# EAGLE design connector_motor (EAGLE 7.2.0)
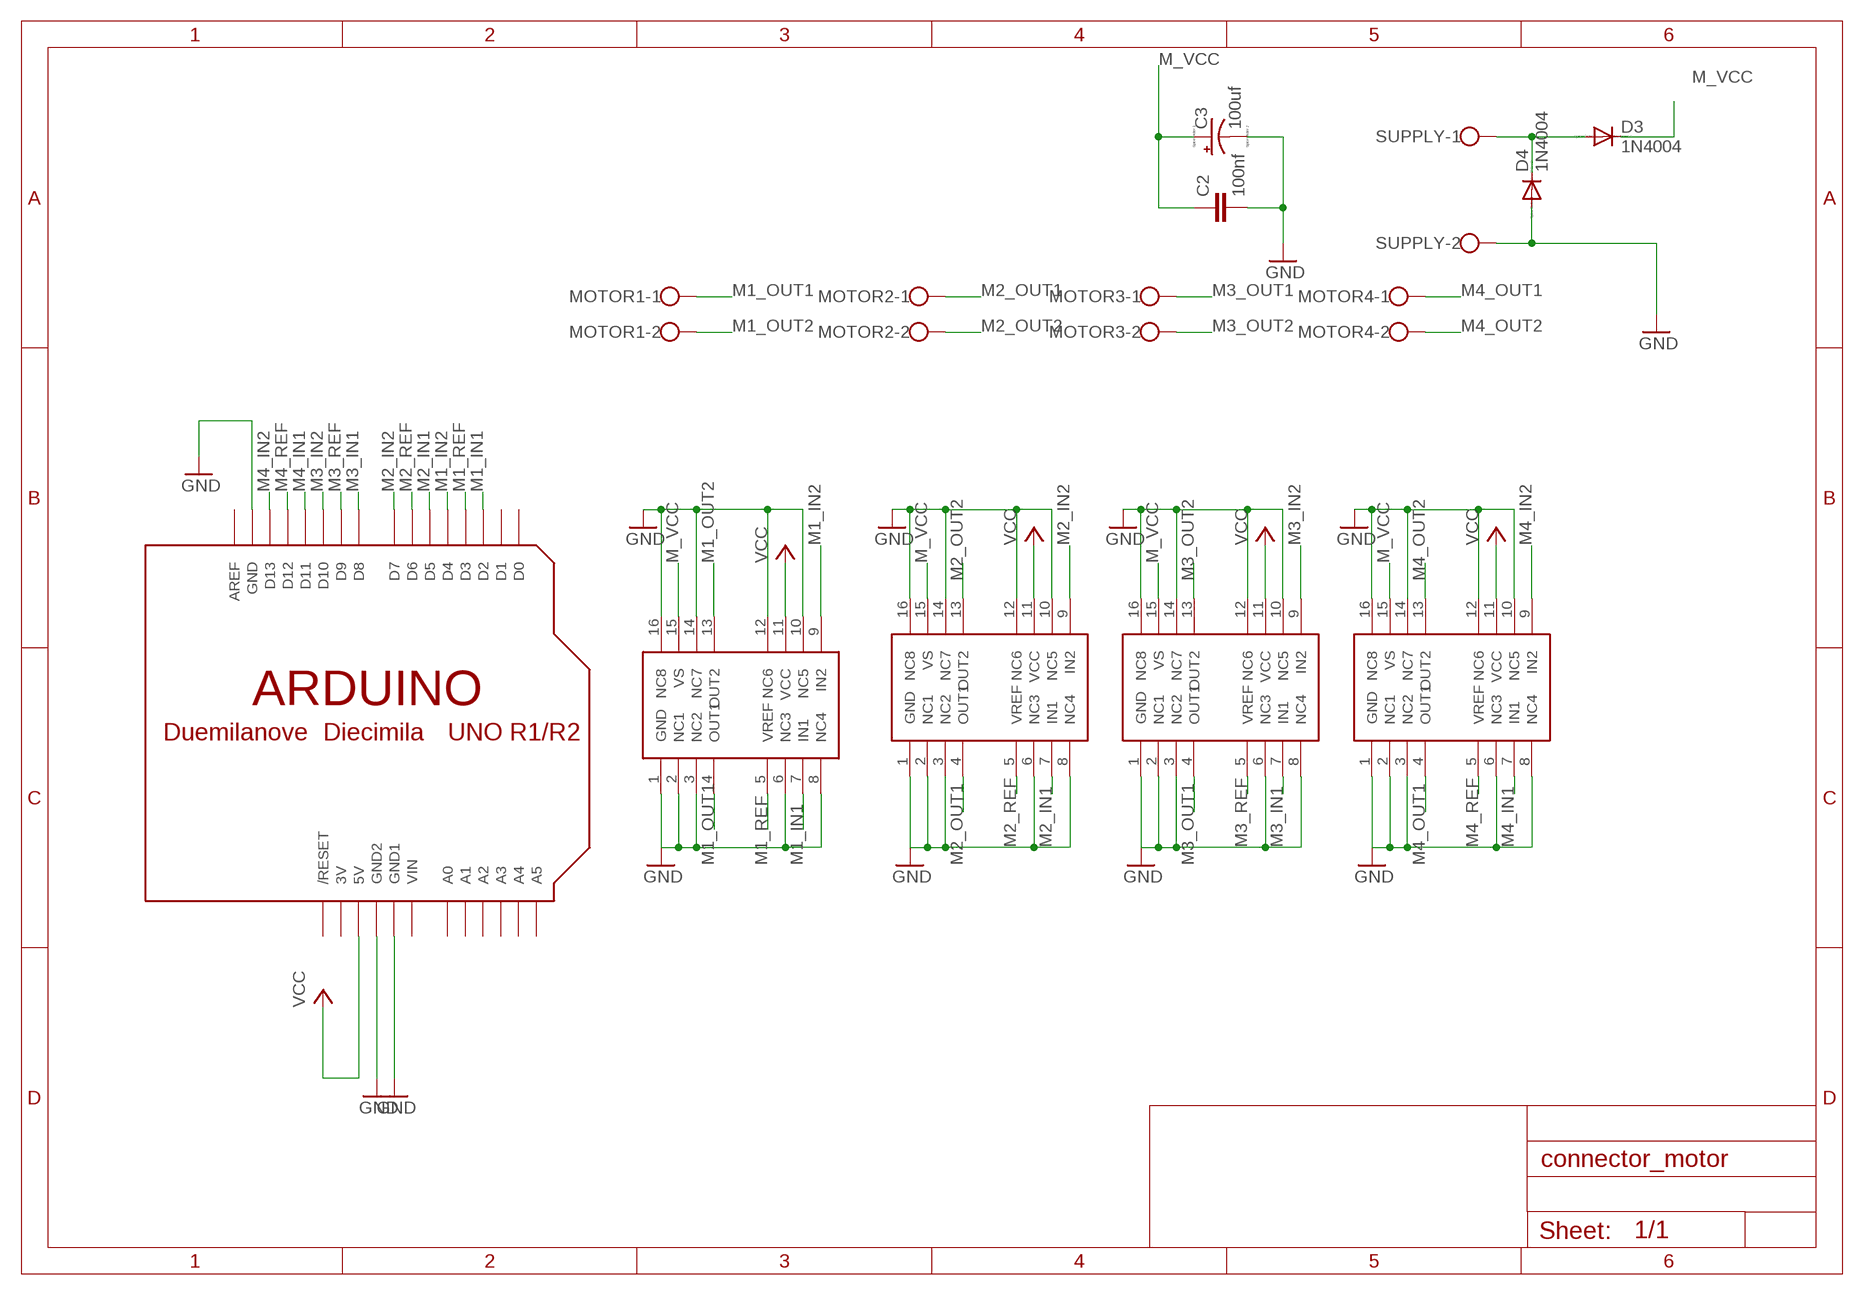
[diagram p0: schematic, sheet 1]

## Parts
C2  100nf  C-EUC0603  [C0603]
C3  100uf  CPOL-US153CLV-0405  [153CLV-0405]
D3  1N4004  [DO41-10]
D4  1N4004  [DO41-10]
MOTOR1  W237-102  [W237-102]
MOTOR2  W237-102  [W237-102]
MOTOR3  W237-102  [W237-102]
MOTOR4  W237-102  [W237-102]
SUPPLY  W237-102  [W237-102]
U$1  ARDUINO-NOHOLE  [ARDUINO-NOHOLE]
U$2  MOTOR-DRIVER-TA7281FG  [MOTOR-DRIVER-TA7291FG]
U$3  MOTOR-DRIVER-TA7281FG  [MOTOR-DRIVER-TA7291FG]
U$4  MOTOR-DRIVER-TA7281FG  [MOTOR-DRIVER-TA7291FG]
U$5  MOTOR-DRIVER-TA7281FG  [MOTOR-DRIVER-TA7291FG]

## Nets
GND: C2.2 C3.- D4.A SUPPLY.2 U$1.GND U$1.GND1 U$1.GND2 U$2.1(GND) U$2.2(NC1) U$2.3(NC2) U$2.6(NC3) U$2.8(NC4) U$2.10(NC5) U$2.12(NC6) U$2.14(NC7) U$2.16(NC8) U$3.1(GND) U$3.2(NC1) U$3.3(NC2) U$3.6(NC3) U$3.8(NC4) U$3.10(NC5) U$3.12(NC6) U$3.14(NC7) U$3.16(NC8) U$4.1(GND) U$4.2(NC1) U$4.3(NC2) U$4.6(NC3) U$4.8(NC4) U$4.10(NC5) U$4.12(NC6) U$4.14(NC7) U$4.16(NC8) U$5.1(GND) U$5.2(NC1) U$5.3(NC2) U$5.6(NC3) U$5.8(NC4) U$5.10(NC5) U$5.12(NC6) U$5.14(NC7) U$5.16(NC8)
M1_IN1: U$1.D2 U$3.7(IN1)
M1_IN2: U$1.D4 U$3.9(IN2)
M1_OUT1: MOTOR1.1 U$3.4(OUT1)
M1_OUT2: MOTOR1.2 U$3.13(OUT2)
M1_REF: U$1.D3 U$3.5(VREF)
M2_IN1: U$1.D5 U$4.7(IN1)
M2_IN2: U$1.D7 U$4.9(IN2)
M2_OUT1: MOTOR2.1 U$4.4(OUT1)
M2_OUT2: MOTOR2.2 U$4.13(OUT2)
M2_REF: U$1.D6 U$4.5(VREF)
M3_IN1: U$1.D8 U$2.7(IN1)
M3_IN2: U$1.D10 U$2.9(IN2)
M3_OUT1: MOTOR3.1 U$2.4(OUT1)
M3_OUT2: MOTOR3.2 U$2.13(OUT2)
M3_REF: U$1.D9 U$2.5(VREF)
M4_IN1: U$1.D11 U$5.7(IN1)
M4_IN2: U$1.D13 U$5.9(IN2)
M4_OUT1: MOTOR4.1 U$5.4(OUT1)
M4_OUT2: MOTOR4.2 U$5.13(OUT2)
M4_REF: U$1.D12 U$5.5(VREF)
M_VCC: C2.1 C3.+ D3.C U$2.15(VS) U$3.15(VS) U$4.15(VS) U$5.15(VS)
N$1: D3.A D4.C SUPPLY.1
VCC: U$1.5V U$2.11(VCC) U$3.11(VCC) U$4.11(VCC) U$5.11(VCC)
Unconnected: U$1.A0 U$1.A1 U$1.A2 U$1.A3 U$1.A4 U$1.A5 U$1.AREF U$1.D0 U$1.D1 U$1.RESET(/RESET)

## Power pins joined to a net without a drawn wire
3V: U$1.3V
VIN: U$1.VIN

## Library data of the parts
C2 = rcl:C-EU: CAPACITOR, European symbol
C3 = resistor:CPOL-US: POLARIZED CAPACITOR, American symbol
D3 D4 = diode:1N4004: DIODE general purpose rectifier, 1 A
MOTOR1-MOTOR4 SUPPLY = con-wago-500:W237-102: WAGO SCREW CLAMP; MPN: 237-102; OC_FARNELL: unknown; OC_NEWARK: 70K9898
U$1 = adafruit:ARDUINO: Arduino Diecimila/Duemilanove Make a shield with ease, this package has all the named pins as well as the two mounting drill holes and an outline of the USB and DC power connector. The outline is on the DIMENSION layer, so if your board house uses it they will cut the outline to match. http://www.ladyada.net/library/pcb/eaglelibrary.html
U$2-U$5 = gclue:MOTOR-DRIVER-TA7281FG

## Board
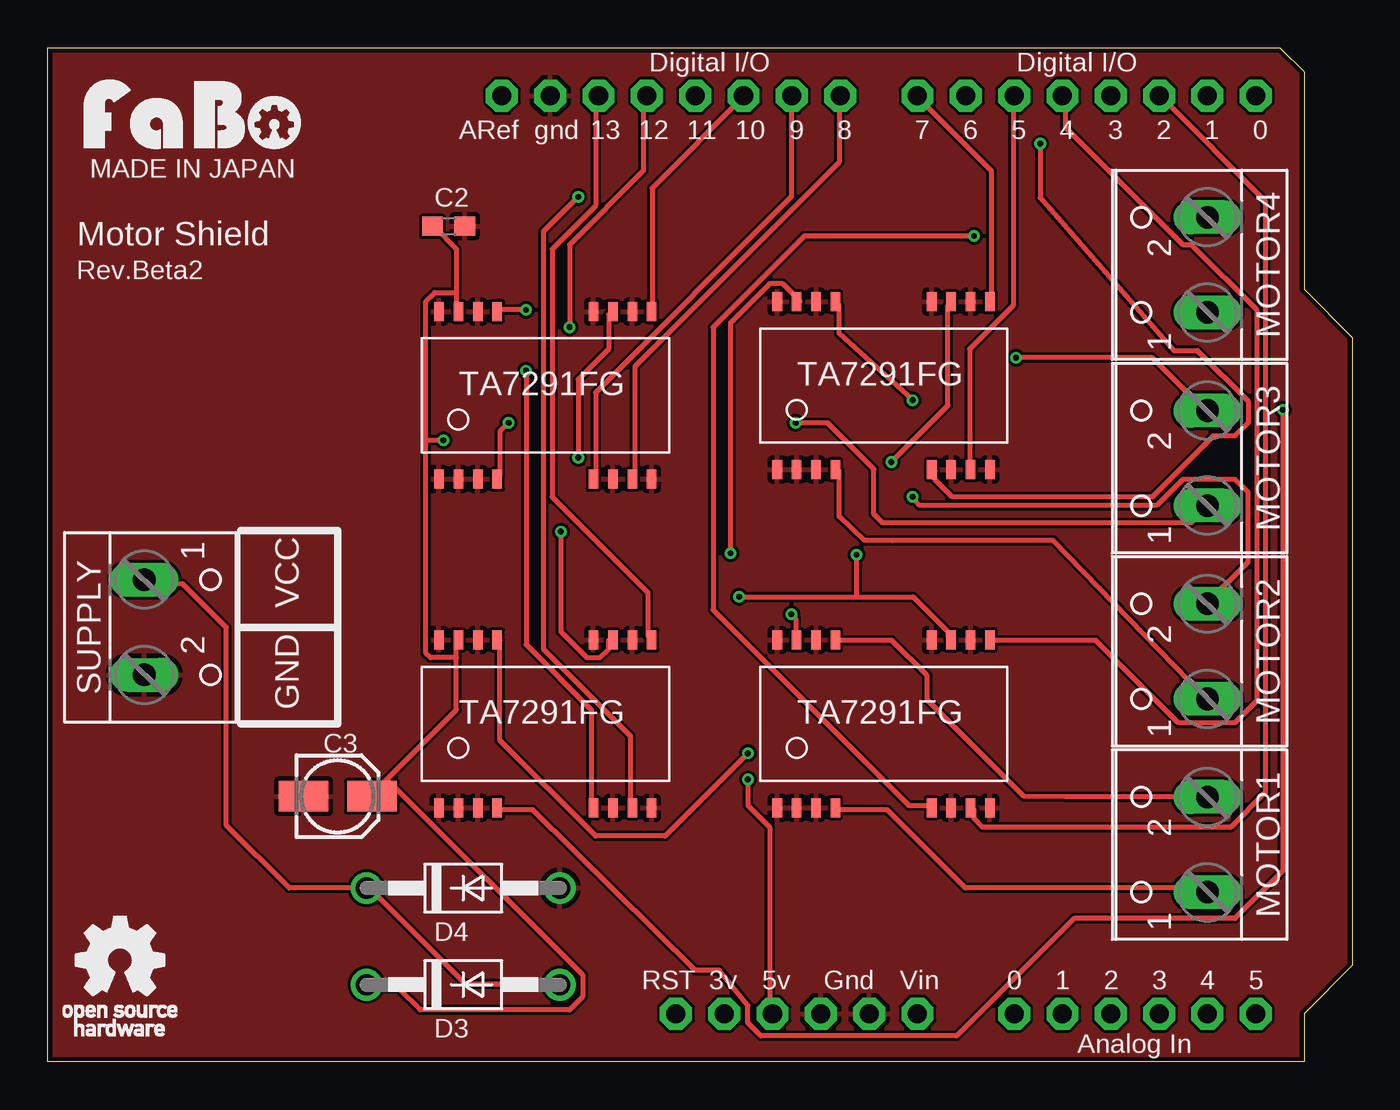
[diagram p1: board, top side]
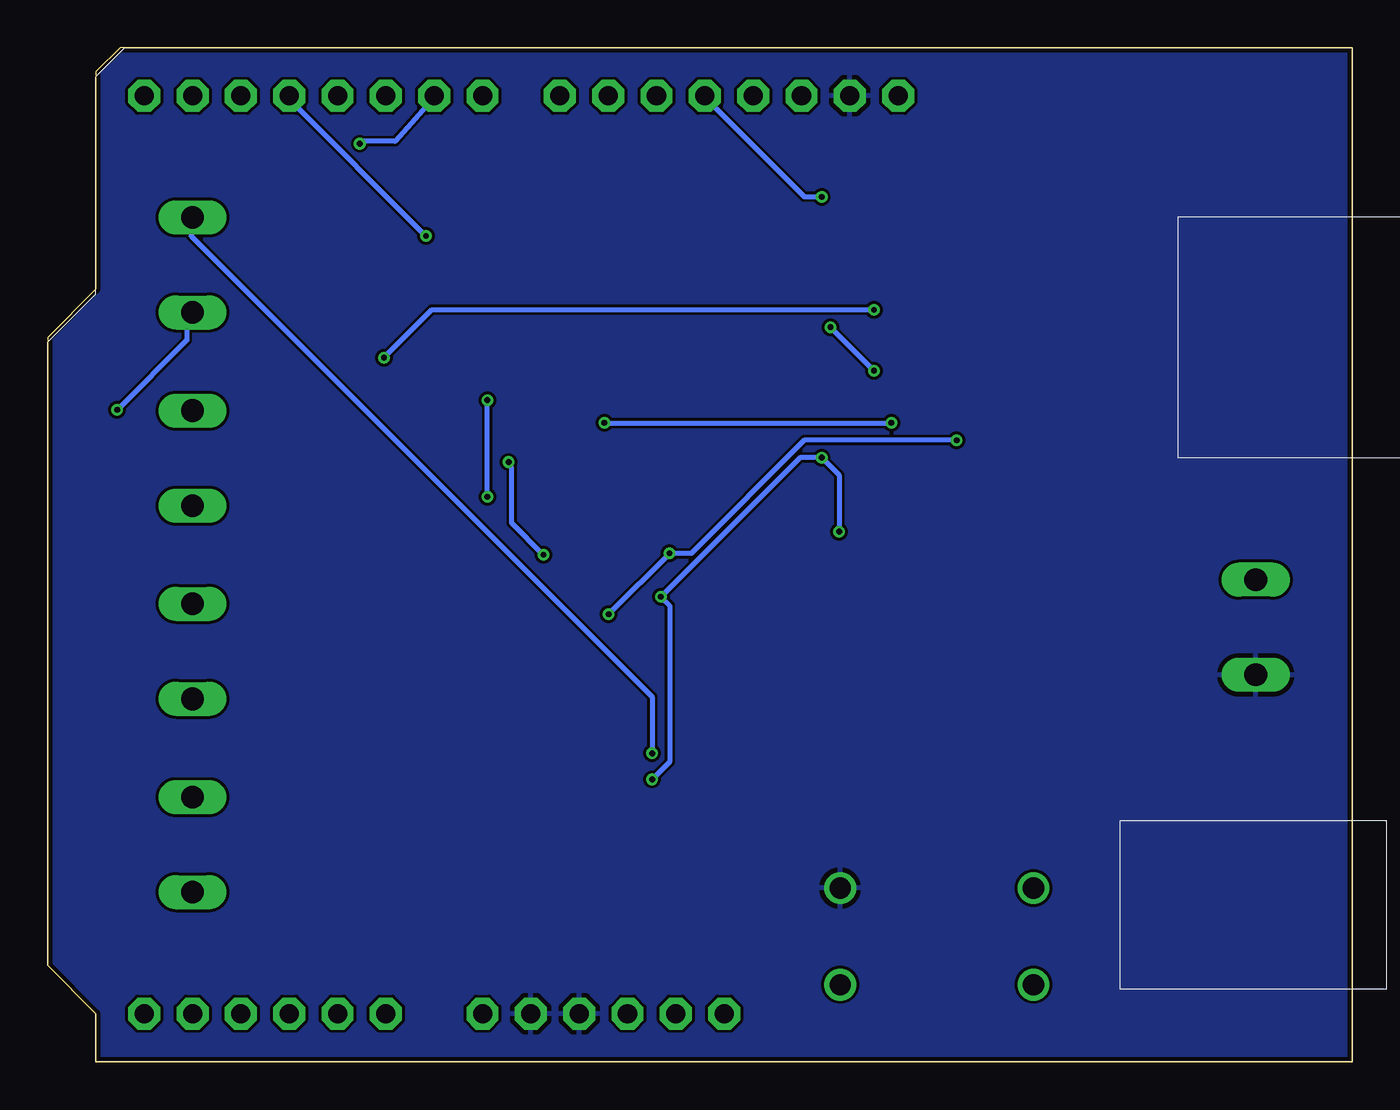
[diagram p2: board, bottom side, seen from below]

Size 68.58 x 53.34 mm. Coordinates in mm from the lower left corner, seen from the top.
Outline: 0,0 0,53.34 64.77,53.34 66.04,52.07 66.04,40.64 68.58,38.1 68.58,5.08 66.04,2.54 66.04,0 0,0
Copper layers (1*16): Top 0.035mm / dielectric 1.5mm / Bottom 0.035mm
Design rules "Elecrow_2-layer_eagle_rule": minimum track width 6mil, minimum drill 12mil, track to track 6mil, track to pad 6mil, pad to pad 6mil, via to via 6mil, smd to smd 0mil, copper to edge 10mil, drill to drill 10mil, minimum pad ring 10mil, minimum via ring 6mil, stop-mask expansion 2mil, vias tented up to drill 100mil, thermal gap 10mil

### Footprints (pad centres in the part's own frame; a part is rotated, then mirrored left to right if it is on the bottom)
C0603 = smd 1.1 x 1: 1 -0.85,0; 2 0.85,0
153CLV-0405 = smd 2.6 x 1.6: + 1.8,0; - -1.8,0
DO41-10 = drill 1.118: A 5.08,0; C -5.08,0
W237-102 = drill 1.194 long: 1 -2.5,-1.27; 2 2.5,-1.27
ARDUINO-NOHOLE = drill 1 pad 1.676 octagon: 3V 35.56,2.54; 5V 38.1,2.54; A0 50.8,2.54; A1 53.34,2.54; A2 55.88,2.54; A3 58.42,2.54; A4 60.96,2.54; A5 63.5,2.54; AREF 23.876,50.8; D0 63.5,50.8; D1 60.96,50.8; D2 58.42,50.8; D3 55.88,50.8; D4 53.34,50.8; D5 50.8,50.8; D6 48.26,50.8; D7 45.72,50.8; D8 41.656,50.8; D9 39.116,50.8; D10 36.576,50.8; D11 34.036,50.8; D12 31.496,50.8; D13 28.956,50.8; GND 26.416,50.8; GND1 43.18,2.54; GND2 40.64,2.54; RESET 33.02,2.54; VIN 45.72,2.54
MOTOR-DRIVER-TA7291FG = smd 0.5 x 1: 1 -6.1,-4.41; 2 -5.08,-4.41; 3 -4.06,-4.41; 4 -3.04,-4.41; 5 2.02,-4.41; 6 3.04,-4.41; 7 4.06,-4.41; 8 5.08,-4.41; 9 5.08,4.41; 10 4.06,4.41; 11 3.04,4.41; 12 2.02,4.41; 13 -3.04,4.41; 14 -4.06,4.41; 15 -5.08,4.41; 16 -6.1,4.41

### Placement (x,y rotation side)
C2  21.08,43.94 0 top
C3  15.24,13.97 0 top
D3  21.84,4.06 0 top
D4  21.84,9.14 0 top
MOTOR1  59.69,11.43 90 top
MOTOR2  59.69,21.59 90 top
MOTOR3  59.69,31.75 90 top
MOTOR4  59.69,41.91 90 top
SUPPLY  6.35,22.86 270 top
U$1  0,0 0 top
U$2  26.67,35.05 0 top
U$3  44.45,17.78 0 top
U$4  44.45,35.56 0 top
U$5  26.67,17.78 0 top
U$7  [LOGO_FABO_M]  7.62,48.01 0 top
U$8  [LOGO_OSHW_T_M]  3.81,5.33 0 top

### Tracks (layer width: path | path; a pad name or v marks a point on that pad's centre or on a via)
GND
  pour Bottom: -1.27,54.61 69.85,54.61 69.85,-1.27 -1.27,-1.27
  pour Top: -1.27,54.61 69.85,54.61 69.85,-1.27 -1.27,-1.27
M1_IN1
  Top 0.254: U$3.7 48.69,13.26 48.69,12.8 49.15,12.34 62.18,12.34 64.01,14.17 64.01,45.26 58.52,50.75 U$1.D2
M1_IN2
  Top 0.254: U$3.9 49.61,22.17 55.09,22.17 59.44,17.83 62.41,17.83 63.55,18.97 63.55,39.55 60.12,42.98 59.66,42.98 53.49,49.15 53.49,50.75 U$1.D4
M1_OUT1
  Top 0.254: U$3.4 41.6,13.26 44.12,13.26 48.23,9.14 60.81,9.14 MOTOR1.1
M1_OUT2
  Top 0.254: U$3.13 41.6,22.17 44.37,22.17 46.23,20.32 46.23,19.05 51.31,13.97 53.49,13.95 60.81,13.95 MOTOR1.2
M1_REF  (via drill 0.3)
  Top 0.254: v48.69,43.43 39.78,43.43 34.98,38.63 34.98,23.77 45.26,13.49 46.41,13.49 U$3.5
  Bottom 0.254: v48.69,43.43 56.01,50.75 U$1.D3
M2_IN1
  Top 0.254: U$4.7 48.46,31.32 48.46,37.49 50.75,39.78 50.75,50.75 U$1.D5
M2_IN2
  Top 0.254: U$4.9 49.61,40.01 49.61,46.86 45.72,50.75 U$1.D7
M2_OUT1
  Top 0.254: U$4.4 41.6,31.09 41.6,28.68 42.93,27.43 44.12,27.43 44.4,27.41 52.86,27.41 60.81,19.2 MOTOR2.1
M2_OUT2  (via drill 0.3)
  Top 0.254: v45.47,34.8 41.6,38.3 41.6,39.78 U$4.13 | v45.47,29.72 45.82,29.26 58.29,29.26 59.66,30.63 62.41,30.63 63.09,29.95 63.09,26.29 61.04,24.23 MOTOR2.2
  Bottom 0.254: v45.47,29.72 v45.47,34.8
M2_REF  (via drill 0.3)
  Top 0.254: v52.17,48.28 52.17,45.44 59.18,37.41 60.43,37.41 63.09,34.75 63.09,33.6 62.41,32.92 61.27,32.92 58.06,29.72 47.55,29.72 46.63,30.63 46.63,31.09 U$4.5
  Bottom 0.254: v52.17,48.28 52.05,48.41 50.32,48.41 48.23,50.75 U$1.D6
M3_IN1
  Top 0.254: U$2.7 30.86,30.86 30.86,36.58 41.6,47.32 41.6,50.75 U$1.D8
M3_IN2
  Top 0.254: U$2.9 31.77,39.55 31.77,45.95 36.58,50.75 U$1.D10
M3_OUT1  (via drill 0.3)
  Top 0.254: v24.23,33.6 23.77,33.15 23.77,30.86 U$2.4 | v39.32,33.6 41,33.6 43.43,31.17 43.43,28.8 43.89,28.35 60.12,28.35 60.81,29.03 MOTOR3.1
  Bottom 0.254: v39.32,33.6 v24.23,33.6
M3_OUT2  (via drill 0.3)
  Top 0.254: v25.15,39.55 23.77,39.55 U$2.13 | v50.9,37.03 58.06,37.03 60.81,34.29 MOTOR3.2
  Bottom 0.254: v25.15,39.55 48.39,39.55 v50.9,37.03
M3_REF
  Top 0.254: U$2.5 28.8,30.86 28.8,35.2 39.09,45.49 39.09,50.75 U$1.D9
M4_IN1  (via drill 0.3)
  Top 0.254: v27.89,45.49 26.06,43.66 26.06,21.72 30.63,17.14 30.63,13.49 U$5.7
  Bottom 0.254: v27.89,45.49 28.8,45.49 34.06,50.75 U$1.D11
M4_IN2
  Top 0.254: U$5.9 31.55,22.4 31.55,24.69 26.52,29.72 26.52,42.75 28.8,45.03 28.8,50.75 U$1.D13
M4_OUT1  (via drill 0.3)
  Top 0.254: v64.92,34.29 64.92,10.06 62.41,7.54 53.95,7.54 47.78,1.37 37.49,1.37 36.8,2.06 36.8,2.97 35.31,4.83 34.04,4.83 25.5,13.26 23.77,13.26 U$5.4
  Bottom 0.254: v64.92,34.29 61.27,37.95 61.27,39.09 61.04,39.32 MOTOR4.1
M4_OUT2  (via drill 0.3)
  Top 0.254: v36.8,16.23 32.46,11.89 28.8,11.89 23.77,16.92 23.77,22.17 U$5.13
  Bottom 0.254: v36.8,16.23 36.8,19.2 61.04,43.43 61.04,44.35 MOTOR4.2
M4_REF  (via drill 0.3)
  Top 0.254: v25.15,36.35 25.15,21.95 28.57,18.52 28.57,13.49 U$5.5 | v27.43,38.63 27.43,42.98 31.32,46.86 31.32,50.75 U$1.D12
  Bottom 0.254: v27.43,38.63 v25.15,36.35
M_VCC  (via drill 0.3)
  Top 0.254: v39.09,23.55 39.32,23.32 39.32,22.4 U$3.15 | v35.89,26.75 35.89,38.86 37.95,40.92 38.63,40.92 39.55,40.01 U$4.15 | 21.49,40.46 21.49,42.75 20.34,43.89 C2.1 | 21.49,40.46 21.49,39.55 U$2.15 | 21.49,21.26 21.49,18.52 17.83,14.86 | 21.49,21.26 21.49,22.17 U$5.15 | 17.83,14.86 17.14,14.17 C3.+ | 21.49,40.46 20.34,40.46 19.89,40.01 19.89,32.69 | 19.89,32.69 19.89,21.49 20.12,21.26 21.49,21.26 | 17.83,14.86 28.12,4.57 28.12,3.43 27.43,2.74 19.58,2.74 18.44,3.89 16.92,3.89 D3.C | 19.89,32.69 v20.8,32.69
  Bottom 0.254: v39.09,23.55 v35.89,26.75 34.75,26.75 28.8,32.69 v20.8,32.69
N$1
  Top 0.254: D3.A 26.75,4.12 21.95,4.12 16.92,9.14 D4.C 12.7,9.14 9.4,12.45 9.4,22.86 7.11,25.15 5.26,25.15 SUPPLY.1
VCC  (via drill 0.3)
  Top 0.254: v26.98,27.89 26.98,22.63 28.35,21.26 29.03,21.26 29.49,21.72 29.49,22.17 U$5.11 | v27.89,31.77 27.89,35.89 29.49,37.49 29.49,39.32 U$2.11 | v36.35,24.46 42.52,24.46 | 42.52,24.46 45.49,24.46 47.32,22.63 47.32,22.4 U$3.11 | v44.35,31.55 47.32,34.52 47.32,39.78 U$4.11 | 42.52,24.46 v42.52,26.67 | v36.8,14.86 36.8,13.49 37.95,12.34 37.95,2.74 U$1.5V
  Bottom 0.254: v26.98,27.89 26.98,30.86 v27.89,31.77 29.03,31.77 v36.35,24.46 35.89,24 35.89,15.77 v36.8,14.86 | v42.52,26.67 44.2,28.35 44.2,31.24 v44.35,31.55

### Text on the board
tPlace: MADE IN JAPAN | Motor Shield | Rev.Beta2 | VCC | GND